# Altium schematic sheet AnalogInputs.SchDoc
size A3
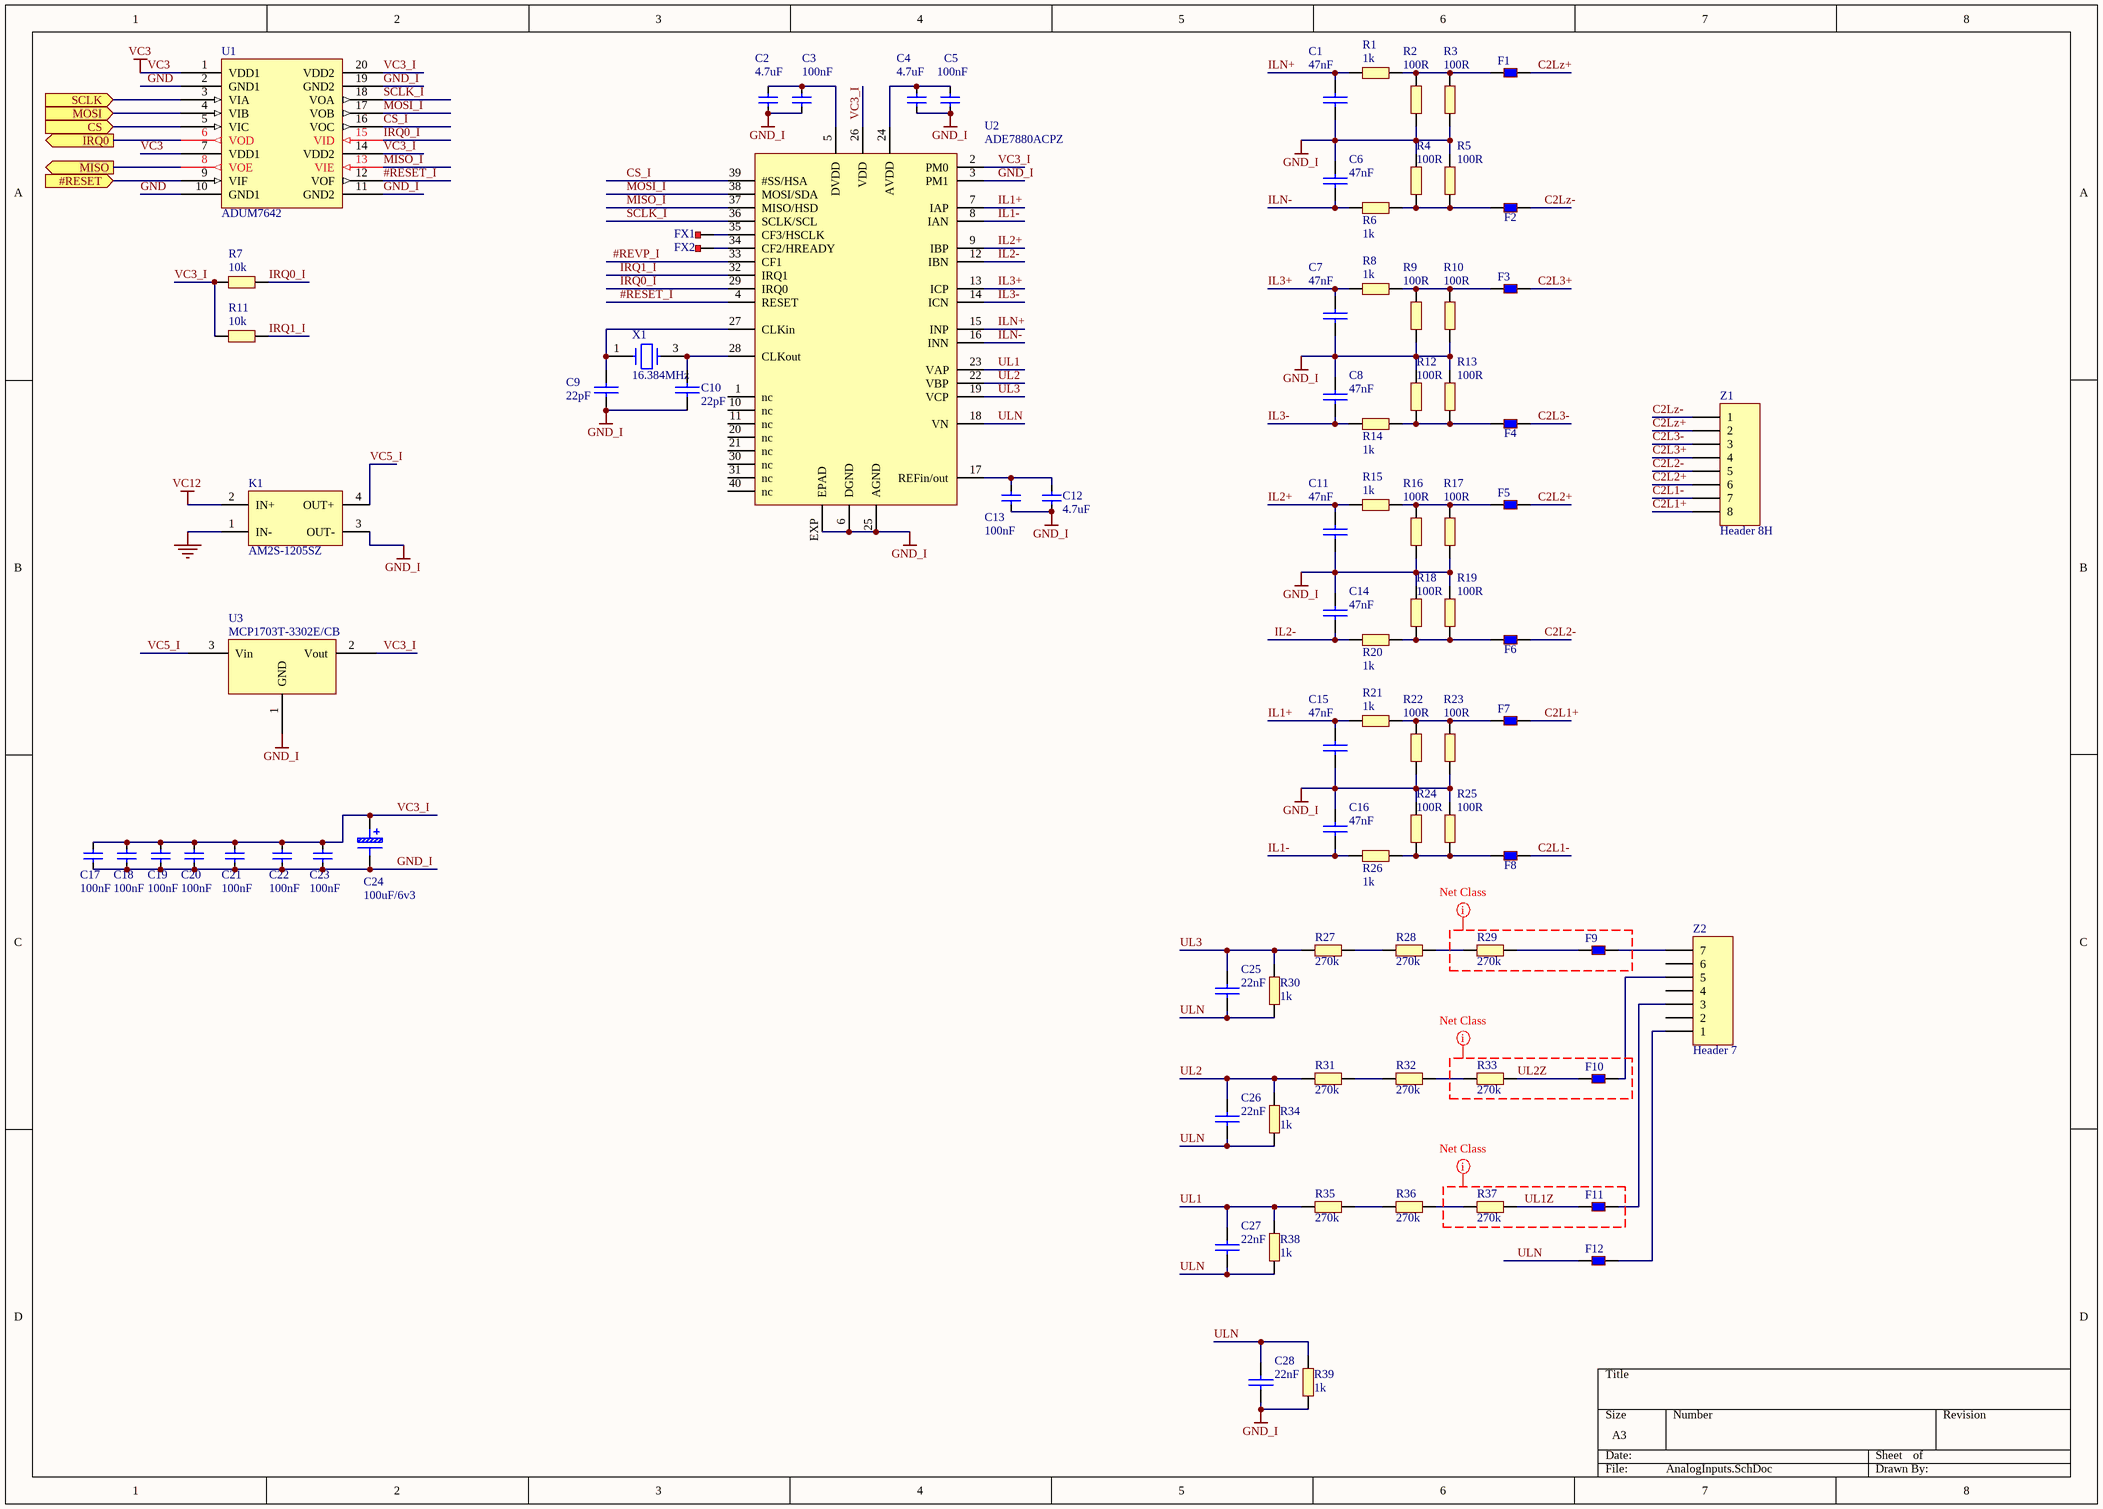
[diagram p0: AnalogInputs.SchDoc]

## Parts
C1  47nF  [0603C]
C2  4.7uF  [0603C]
C3  100nF  [0603C]
C4  4.7uF  [0603C]
C5  100nF  [0603C]
C6  47nF  [0603C]
C7  47nF  [0603C]
C8  47nF  [0603C]
C9  22pF  [0603C]
C10  22pF  [0603C]
C11  47nF  [0603C]
C12  4.7uF  [0603C]
C13  100nF  [0603C]
C14  47nF  [0603C]
C15  47nF  [0603C]
C16  47nF  [0603C]
C17  100nF  [0603C]
C18  100nF  [0603C]
C19  100nF  [0603C]
C20  100nF  [0603C]
C21  100nF  [0603C]
C22  100nF  [0603C]
C23  100nF  [0603C]
C24  100uF/6v3  [CAP_C]
C25  22nF  [0603C]
C26  22nF  [0603C]
C27  22nF  [0603C]
C28  22nF  [0603C]
F1  BLM18BB141SN1D  [0603L]  (value not drawn)
F2  BLM18BB141SN1D  [0603L]  (value not drawn)
F3  BLM18BB141SN1D  [0603L]  (value not drawn)
F4  BLM18BB141SN1D  [0603L]  (value not drawn)
F5  BLM18BB141SN1D  [0603L]  (value not drawn)
F6  BLM18BB141SN1D  [0603L]  (value not drawn)
F7  BLM18BB141SN1D  [0603L]  (value not drawn)
F8  BLM18BB141SN1D  [0603L]  (value not drawn)
F9  BLM18BB141SN1D  [0603L]  (value not drawn)
F10  BLM18BB141SN1D  [0603L]  (value not drawn)
F11  BLM18BB141SN1D  [0603L]  (value not drawn)
F12  BLM18BB141SN1D  [0603L]  (value not drawn)
FX1  (no value)  [PP_SMD4]
FX2  (no value)  [PP_SMD4]
K1  AM2S-1205SZ  [DCDC_SIL4]
R1  1k  [0603R]
R2  100R  [1206RM]
R3  100R  [AXIAL_0.25W_1]
R4  100R  [1206RM]
R5  100R  [AXIAL_0.25W_1]
R6  1k  [0603R]
R7  10k  [0603R]
R8  1k  [0603R]
R9  100R  [1206RM]
R10  100R  [AXIAL_0.25W_1]
R11  10k  [0603R]
R12  100R  [1206RM]
R13  100R  [AXIAL_0.25W_1]
R14  1k  [0603R]
R15  1k  [0603R]
R16  100R  [1206RM]
R17  100R  [AXIAL_0.25W_1]
R18  100R  [1206RM]
R19  100R  [AXIAL_0.25W_1]
R20  1k  [0603R]
R21  1k  [0603R]
R22  100R  [1206RM]
R23  100R  [AXIAL_0.25W_1]
R24  100R  [1206RM]
R25  100R  [AXIAL_0.25W_1]
R26  1k  [0603R]
R27  270k  [1206]
R28  270k  [1206]
R29  270k  [1206]
R30  1k  [0805R]
R31  270k  [1206]
R32  270k  [1206]
R33  270k  [1206]
R34  1k  [0805R]
R35  270k  [1206]
R36  270k  [1206]
R37  270k  [1206]
R38  1k  [0805R]
R39  1k  [0805R]
U1  ADUM7642  [RQ-20]
U2  ADE7880ACPZ  [LFCSP_WQ40]
U3  MCP1703T-3302E/CB  [SOT-23]
X1  16.384MHz  [XTAL_2.5_2]
Z1  Header 8H  [JST-B8B-XH-A]
Z2  Header 7  [JST-B7B-XH-A]

## Ports
#RESET (in), CS (in), IRQ0 (out), MISO (out), MOSI (in), SCLK (in)

## Nets
GND: K1.1(IN-) U1.2(GND1) U1.10(GND1)
GND_I: C1.2 C2.1 C3.1 C4.1 C5.1 C6.2 C7.2 C8.2 C9.1 C10.1 C11.2 C12.1 C13.1 C14.2 C15.2 C16.2 C17.1 C18.1 C19.1 C20.1 C21.1 C22.1 C23.1 C24.1 C28.1 K1.3(OUT-) R2.2 R3.2 R4.2 R5.2 R9.2 R10.2 R12.2 R13.2 R16.2 R17.2 R18.2 R19.2 R22.2 R23.2 R24.2 R25.2 R39.1 U1.11(GND2) U1.19(GND2) U2.3(PM1) U2.6(DGND) U2.25(AGND) U2.EXP(EPAD) U3.1(GND)
VC3: U1.1(VDD1) U1.7(VDD1)
VC12: K1.2(IN+)
#RESET: U1.9(VIF) ; port #RESET
#RESET_I: U1.12(VOF) U2.4(RESET)
#REVP_I: U2.33(CF1)
C2L1+: F7.1 Z1.8
C2L1-: F8.1 Z1.7
C2L2+: F5.1 Z1.6
C2L2-: F6.1 Z1.5
C2L3+: F3.1 Z1.4
C2L3-: F4.1 Z1.3
C2Lz+: F1.1 Z1.2
C2Lz-: F2.1 Z1.1
CS: U1.5(VIC) ; port CS
CS_I: U1.16(VOC) U2.39(#SS/HSA)
IL1+: C15.1 R21.1 U2.7(IAP)
IL1-: C16.1 R26.1 U2.8(IAN)
IL2+: C11.1 R15.1 U2.9(IBP)
IL2-: C14.1 R20.1 U2.12(IBN)
IL3+: C7.1 R8.1 U2.13(ICP)
IL3-: C8.1 R14.1 U2.14(ICN)
ILN+: C1.1 R1.1 U2.15(INP)
ILN-: C6.1 R6.1 U2.16(INN)
IRQ0: U1.6(VOD) ; port IRQ0
IRQ0_I: R7.1 U1.15(VID) U2.29(IRQ0)
IRQ1_I: R11.1 U2.32(IRQ1)
MISO: U1.8(VOE) ; port MISO
MISO_I: U1.13(VIE) U2.37(MISO/HSD)
MOSI: U1.4(VIB) ; port MOSI
MOSI_I: U1.17(VOB) U2.38(MOSI/SDA)
SCLK: U1.3(VIA) ; port SCLK
SCLK_I: U1.18(VOA) U2.36(SCLK/SCL)
UL1: C27.2 R35.1 R38.2 U2.23(VAP)
UL1Z: F11.2 R37.2
UL2: C26.2 R31.1 R34.2 U2.22(VBP)
UL2Z: F10.2 R33.2
UL3: C25.2 R27.1 R30.2 U2.19(VCP)
ULN: C25.1 C26.1 C27.1 C28.2 F12.2 R30.1 R34.1 R38.1 R39.2 U2.18(VN)
VC3_I: C17.2 C18.2 C19.2 C20.2 C21.2 C22.2 C23.2 C24.2 R7.2 R11.2 U1.14(VDD2) U1.20(VDD2) U2.2(PM0) U2.26(VDD) U3.2(Vout)
VC5_I: K1.4(OUT+) U3.3(Vin)
NetC2_2: C2.2 C3.2 U2.5(DVDD)
NetC4_2: C4.2 C5.2 U2.24(AVDD)
NetC9_2: C9.2 U2.27(CLKin) X1.1
NetC10_2: C10.2 U2.28(CLKout) X1.3
NetC12_2: C12.2 C13.2 U2.17(REFin/out)
NetF1_2: F1.2 R1.2 R2.1 R3.1
NetF2_2: F2.2 R4.1 R5.1 R6.2
NetF3_2: F3.2 R8.2 R9.1 R10.1
NetF4_2: F4.2 R12.1 R13.1 R14.2
NetF5_2: F5.2 R15.2 R16.1 R17.1
NetF6_2: F6.2 R18.1 R19.1 R20.2
NetF7_2: F7.2 R21.2 R22.1 R23.1
NetF8_2: F8.2 R24.1 R25.1 R26.2
NetF9_1: F9.1 Z2.7
NetF9_2: F9.2 R29.2
NetF10_1: F10.1 Z2.5
NetF11_1: F11.1 Z2.3
NetF12_1: F12.1 Z2.1
NetFX1_1: FX1.1 U2.35(CF3/HSCLK)
NetFX2_1: FX2.1 U2.34(CF2/HREADY)
NetR27_2: R27.2 R28.1
NetR28_2: R28.2 R29.1
NetR31_2: R31.2 R32.1
NetR32_2: R32.2 R33.1
NetR35_2: R35.2 R36.1
NetR36_2: R36.2 R37.1

Not connected (* = marked no-connect by the designer): U2 1(nc) 10(nc) 11(nc) 20(nc) 21(nc) 30(nc) 31(nc) 40(nc); Z2 2 4 6

## Layout directives
net class Class_U2: UL2Z
net class Class_U1: (no net found under the mark)
net class Class_U3: UL1Z

## Library data of the parts
C1 C6-C11 C14-C16 C25-C28 = CAP: Capacitor
C2-C5 C12 C13 C17-C23 = CAP
C24 = CapTantal
F1-F12 = KORALIK: Koralik ferrytowy
FX1 FX2 = PP_RT
K1 = DCDC_SIL
R1-R39 = RES3
U1 = ADUM7642: Dostawca: Mouser; Dostawca.Symbol: ADUM7642CRQZ
U2 = ADE7880
U3 = MCP1703T-3302E/CB: Dostawca: TME; Dostawca.Symbol: MCP1703T3302ECB
X1 = XTAL_32K_NX3215SA: Crystal 32.768kHz, 6pF, -+20PPM, R=50K, SMD; Manuf_1: NDK; Manuf_Part_1: NX3215SA 32.768KHz EXS00A-MU00525; Description: Crystal 32.768kHz, 6pF, -+20PPM, NDK only for ST, Type NX3215SA,  NDK Spec EXS00A-MU00525; ECCN_US/EU: EAR99/NEC; Ref St: 9157034; NDK Ref: X3101802; Provided: ST; Dostawca.Symbol: 32.768K-CFPX217; Dostawca: TME; Distrib: *; Order: NX3215SA 32.768KHz EXS00A-MU00525
Z1 = Header 8H: Header, 8-Pin, Right Angle; LatestRevisionDate: 17-Jul-2002; LatestRevisionNote: Re-released for DXP Platform.; Publisher: Altium Limited
Z2 = Header 7: Header, 7-Pin; LatestRevisionDate: 17-Jul-2002; LatestRevisionNote: Re-released for DXP Platform.; Publisher: Altium Limited